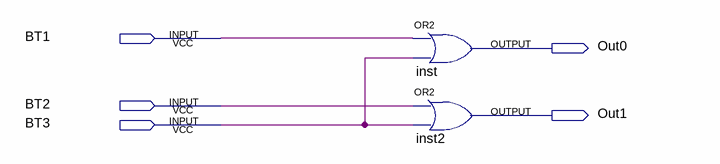
[diagram p0: schematic sheet]
// Quartus schematic BT-Dec.bdf as structural Verilog: 2 symbols, 5 pins
module \BT-Dec  (
  input  BT1,
  input  BT2,
  input  BT3,
  output Out0,
  output Out1
);

  or inst (Out0, BT1, BT3);
  or inst2 (Out1, BT2, BT3);
endmodule
